# Altium schematic sheet Power_Supplies.SchDoc: POE Voltage Regulator
size A3; Author: A.Horvath; Organization: Reichle & De-Massari; Address1: Binzstrasse 32; Address2: 8620 Wetzikon; Address3: Switzerland; DocumentNumber: 11; Revision: V0.1; SheetNumber: 11; SheetTotal: 11
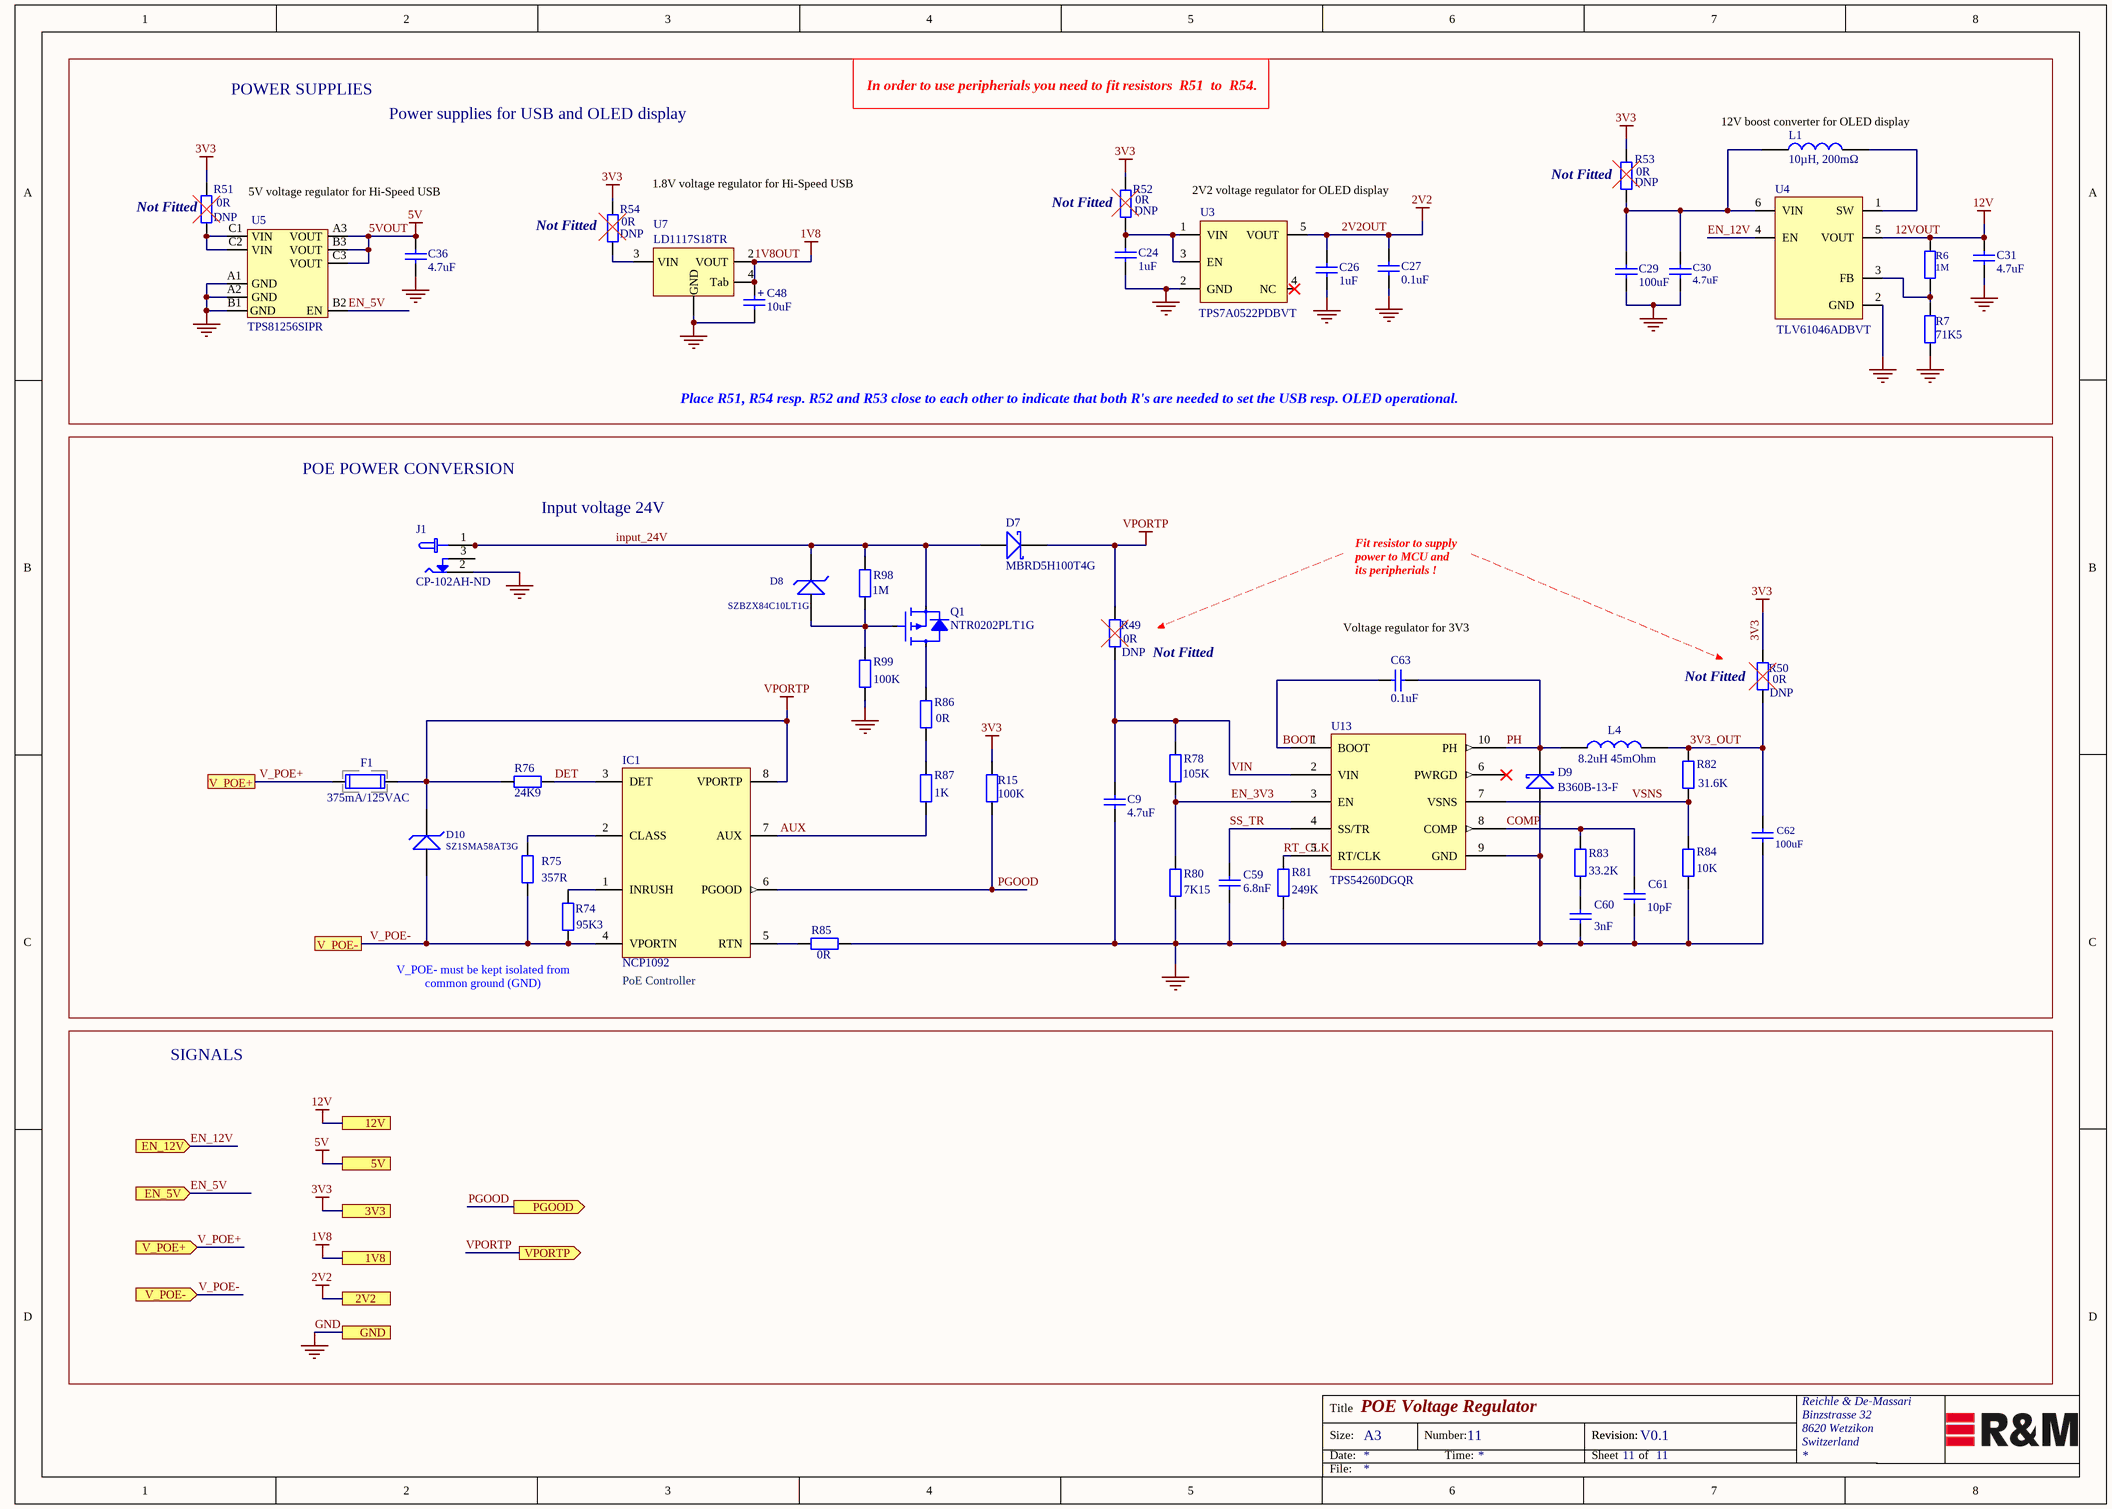
[diagram p0: Power_Supplies.SchDoc]

## Parts
C9  4.7uF  [Ceramic Capacitor 0402 EIA]
C24  1uF  [Ceramic Capacitor 0402 EIA]
C26  1uF  [Ceramic Capacitor 0402 EIA]
C27  0.1uF  [Ceramic Capacitor 0402 EIA]
C29  100uF  [Ceramic Capacitor 1210 EIA]
C30  4.7uF  [CAP-0402[1005] - RFL]
C31  4.7uF  [Ceramic Capacitor 0603 EIA]
C36  4.7uF  [Ceramic Capacitor 0603 EIA]
C48  10uF  [Ceramic Capacitor 1206 - Tantal]
C59  6.8nF  [Ceramic Capacitor 0402 EIA]
C60  3nF  [Ceramic Capacitor 0402 EIA]
C61  10pF  [Ceramic Capacitor 0402 EIA]
C62  100uF  [CAP-1210[3225] - RFL]
C63  0.1uF  [Ceramic Capacitor 0402 EIA]
D7  MBRD5H100T4G  [DPAK_MBRD5H]
D8  SZBZX84C10LT1G  [SOT-23_BZX84]
D9  B360B-13-F  [SMB]
D10  SZ1SMA58AT3G  [SMA_SZ1SMA58AT3G]
F1  375mA/125VAC  [Littlefuse_Holder]
IC1  NCP1092  [SOIC127P602X173-8N]
J1  CP-102AH-ND  [CUI_PJ-102AH]
L1  10µH, 200mΩ  [FDSD0420]
L4  8.2uH 45mOhm  [SRN80408R2Y]
Q1  NTR0202PLT1G  [SOT-23_NTR0202PLT1G]
R6  1M  [Resistor 0402 EIA]
R7  71K5  [Resistor 0402 EIA]
R15  100K  [Resistor 0402 EIA]
R49  DNP  [Resistor 0805 EIA]
R50  DNP  [Resistor 0805 EIA]
R51  DNP  [Resistor 0805 EIA]
R52  DNP  [Resistor 0805 EIA]
R53  DNP  [Resistor 0805 EIA]
R54  DNP  [Resistor 0805 EIA]
R74  95K3  [Resistor 0402 EIA]
R75  357R  [Resistor 0402 EIA]
R76  24K9  [Resistor 0402 EIA]
R78  105K  [Resistor 0402 EIA]
R80  7K15  [Resistor 0402 EIA]
R81  249K  [Resistor 0402 EIA]
R82  31.6K  [Resistor 0402 EIA]
R83  33.2K  [Resistor 0402 EIA]
R84  10K  [Resistor 0402 EIA]
R85  0R  [Resistor 0805 EIA]
R86  0R  [Resistor 0805 EIA]
R87  1K  [Resistor 0402 EIA]
R98  1M  [Resistor 0805 EIA]
R99  100K  [Resistor 0805 EIA]
U3  TPS7A0522PDBVT  [SOT23-5L]
U4  TLV61046ADBVT  [SOT-23-6]
U5  TPS81256SIPR  [BGASIP0009A]
U7  LD1117S18TR  [SOT-223]
U13  TPS54260DGQR  [TPS54260_S-PDSO-G10]

## Ports
1V8, 2V2, 3V3, 5V, 12V, EN_5V (in), EN_12V (in), GND, PGOOD (out), V_POE+ (in), V_POE- (in), VPORTP (out)

## Nets
1V8OUT: C48.1(pos) U7.2(VOUT) U7.4(Tab) ; port 1V8  [also labelled 1V8]
2V2OUT: C26.2 C27.2 U3.5(VOUT) ; port 2V2  [also labelled 2V2]
3V3: R15.1 R50.1 R51.1 R52.1 R53.1 R54.1 ; port 3V3
5VOUT: C36.2 U5.A3(VOUT) U5.B3(VOUT) U5.C3(VOUT) ; port 5V  [also labelled 5V]
12VOUT: C31.2 R6.1 U4.5(VOUT) ; port 12V  [also labelled 12V]
GND: C9.1 C24.1 C26.1 C27.1 C29.1 C30.2(Neg) C31.1 C36.1 C48.2(neg) C59.1 C60.1 C61.1 C62.2(Neg) D9.2(A) J1.2 R7.2 R80.2 R81.2 R84.2 R85.2 R99.2 U3.2(GND) U4.2(GND) U5.A1(GND) U5.A2(GND) U5.B1(GND) U7.1(GND) U13.9(GND) ; port GND
VPORTP: D7.4(K) D10.1(K) F1.2 IC1.8(VPORTP) R49.1 R76.1 ; port VPORTP
3V3_OUT: C62.1(Pos) L4.2 R50.2 R82.1
AUX: IC1.7(AUX) R87.2
BOOT: C63.2 U13.1(BOOT)
COMP: C61.2 R83.1 U13.8(COMP)
DET: IC1.3(DET) R76.2
EN_3V3: R78.2 R80.1 U13.3(EN)
EN_5V: U5.B2(EN) ; port EN_5V
EN_12V: U4.4(EN) ; port EN_12V
input_24V: D7.3(A) D8.3(K) J1.1 Q1.3 R98.1
PGOOD: IC1.6(PGOOD) R15.2 ; port PGOOD
PH: C63.1 D9.1(K) L4.1 U13.10(PH)
RT_CLK: R81.1 U13.5(RT/CLK)
SS_TR: C59.2 U13.4(SS/TR)
V_POE+: F1.1 ; port V_POE+
V_POE-: D10.2(A) IC1.4(VPORTN) R74.2 R75.2 ; port V_POE-
VIN: C9.2 R49.2 R78.1 U13.2(VIN)
VSNS: R82.2 R84.1 U13.7(VSNS)
NetC24_2: C24.2 R52.2 U3.1(VIN) U3.3(EN)
NetC29_2: C29.2 C30.1(Pos) L1.1 R53.2 U4.6(VIN)
NetC60_2: C60.2 R83.2
NetD8_1: D8.1(A) Q1.1 R98.2 R99.1
NetIC1_1: IC1.1(INRUSH) R74.1
NetIC1_2: IC1.2(CLASS) R75.1
NetIC1_5: IC1.5(RTN) R85.1
NetL1_2: L1.2 U4.1(SW)
NetQ1_2: Q1.2 R86.1
NetR6_2: R6.2 R7.1 U4.3(FB)
NetR51_2: R51.2 U5.C1(VIN) U5.C2(VIN)
NetR54_2: R54.2 U7.3(VIN)
NetR86_2: R86.2 R87.1

Not connected (* = marked no-connect by the designer): J1 3; U3 4(NC)*; U13 6(PWRGD)*

## Notes on the sheet
- POWER SUPPLIES
- In order to use peripherials you need to fit resistors  R51  to  R54.
- Power supplies for USB and OLED display
- (near R53) Not Fitted
- (near R53) 0R
- (near L1) 12V boost converter for OLED display
- (near R51) Not Fitted
- (near R51) 0R
- 5V voltage regulator for Hi-Speed USB
- (near R54) Not Fitted
- (near R54) 0R
- 1.8V voltage regulator for Hi-Speed USB
- (near R52) Not Fitted
- (near R52) 0R
- (near U3) 2V2 voltage regulator for OLED display
- Place R51, R54 resp. R52 and R53 close to each other to indicate that both R's are needed to set the USB resp. OLED operational.
- POE POWER CONVERSION
- (near J1) Input voltage 24V
- Fit resistor to supply power to MCU and its peripherials !
- (near R49) 0R
- (near C63) Voltage regulator for 3V3
- (near R49) Not Fitted
- (near R50) Not Fitted
- (near R50) 0R
- V_POE+
- V_POE-
- V_POE- must be kept isolated from common ground (GND)
- (near IC1) PoE Controller
- SIGNALS
- Title
- Size:
- Date:
- A3
- Number:
- Time:
- Revision:
- Sheet
- of
- File:
- (in symbol Cap_10uF_1206_10V) +

## Library data of the parts
C9 = Cap_4.7uF_0402_10V: 4.7µF ±10% 10V Ceramic Capacitor X5R 0402 (1005 Metric); Manufracturer: Samsung Electro-Mechanics; Manufacturer PartNr: CL05A475KP5NRNC; voltage: 10VDC; Replaceable: yes; tolerance: 10%; ComponentLink1Description: mouser; ComponentLink1URL: https://www.mouser.ch/ProductDetail/Murata-Electronics/GRM155R60J475ME47D?qs=sGAEpiMZZMs0AnBnWHyRQIE6q%2f4qwWvwbJmEUwav8%2f4%3d; Dielectric Grade: X5R; Footprint/Package: 0402 (1005 metric); Supplier 1: Digi-Key; Supplier Part Number 1: 1276-1480-1-ND; value: 4.7uF
C24 C26 = Cap_1uF_0402_10V: 1µF ±10% 10V Ceramic Capacitor X7S 0402 (1005 Metric); Manufacturer: Murata; Manufacturer PartNr: GCM155C71A105KE38D; voltage: 10VDC; Replaceable: yes; value: 1uF; tolerance: 10%; Footprint/Package: 0402 (1005 metric); Dielectric Grade: X7S; ComponentLink1Description: mouser; ComponentLink1URL: https://www.mouser.ch/ProductDetail/Murata-Electronics/GCM155C71A105KE38D?qs=sGAEpiMZZMsh%252b1woXyUXj0FEAttKcN54ouz5zO04smg%3d; Supplier Part Number 1: 490-13409-1-ND; Supplier 1: Digi-Key
C27 = Cap_0.1uF_0402_16V: 0.1µF ±20% 16V Ceramic Capacitor X7R 0402 (1005 Metric); Manufacturer: KEMET; Manufacturer PartNr: C0402C104M4RACAUTO; voltage: 16VDC; Replaceable: yes; value: 0.1uF; tolerance: 20%; Footprint/Package: 0402 (1005 Metric); Dielectric Grade: X7R; ComponentLink1Description: mouser; ComponentLink1URL: https://www.mouser.ch/ProductDetail/KEMET/C0402C104M4RACAUTO?qs=sGAEpiMZZMs0AnBnWHyRQB295tntAovf0Dzw3tVX6zRfKTwHFThmZw%3d%3d; Supplier 1: Digi-Key; Supplier Part Number 1: 399-13707-1-ND
C29 = Cap_100uF_1210_6.3V: 100µF ±20% 6.3V Ceramic Capacitor X5R 1206 (3216 Metric); Manufacturer: Murata; Manufacturer PartNr: GRM31CR60J107ME39L; Replaceable: yes; Dielectric Grade: X7S; value: 100uF; tolerance: 20%; voltage: 6.3V; ComponentLink1Description: mouser; ComponentLink1URL: https://www.mouser.ch/ProductDetail/Murata-Electronics/GRM32EC72A106KE05L?qs=sGAEpiMZZMs0AnBnWHyRQN7%2fAA2D2lPPRgsNRWcxCxSMn45aJ02Wig%3d%3d; Footprint/Package: 1210 (3225 metric); Supplier 1: Digi-Key; Supplier Part Number 1: 490-4539-1-ND
C30 = Cap_4.7uF_0402_6.3V: 4.7µF ±20% 6.3V Ceramic Capacitor X5R 0402 (1005 Metric); Manufacturer: Murata; Manufacturer PartNr: GRM155R60J475ME47D; voltage: 6.3VDC; Replaceable: yes; tolerance: ±20%; Supplier 1: Digi-Key; Supplier Part Number 1: 490-5915-1-ND; Dielectric Grade: X5R; value: 4.7uF; Footprint/Package: 0402 (1005 metric)
C31 = Cap_4.7uF_0603_35V: 4.7µF ±10% 35V Ceramic Capacitor X5R 0603 (1608 Metric); Manufracturer: Murata Electronics; Manufacturer PartNr: GRM188R6YA475KE15D; voltage: 35 VDC; Replaceable: yes; value: 4.7uF; tolerance: 10%; Dielectric Grade: X5R; Footprint/Package: 0603 (1608 metric); Supplier 1: Digi-Key; Supplier Part Number 1: 490-7205-1-ND; power: -
C36 = Cap_4.7uF_0603_16V: 4.7µF ±10% 16V Ceramic Capacitor X5R 0603 (1608 Metric); Manufracturer: Murata Electronics; Manufacturer PartNr: GRM188R61C475KAAJD; voltage: 16 VDC; Replaceable: yes; value: 4.7uF; tolerance: 10%; Dielectric Grade: X5R; Footprint/Package: 0603 (1608 metric); Supplier 1: Digi-Key; Supplier Part Number 1: 490-10481-1-ND
C48 = Cap_10uF_1206_10V: 10µF Molded Tantalum Capacitors 10V 1206 (3216 Metric) 3.4Ohm; Manufacturer: Vishay Sprague; Manufacturer PartNr: 293D106X9010A2TE3; tolerance: ±10%; Replaceable: yes; Dielectric Grade: Tantal; value: 10uF; voltage: 10V; ComponentLink1Description: mouser; ComponentLink1URL: https://www.mouser.ch/ProductDetail/Murata-Electronics/GRM32EC72A106KE05L?qs=sGAEpiMZZMs0AnBnWHyRQN7%2fAA2D2lPPRgsNRWcxCxSMn45aJ02Wig%3d%3d; Footprint/Package: 1206 (3216 metric); Supplier 1: Digi-Key; Supplier Part Number 1: 718-1121-1-ND
C59 = Cap_6.8nF_0402_50V: 6800pF ±10% 50V Ceramic Capacitor X7R 0402 (1005 Metric); Manufacturer: KEMET; Manufacturer PartNr: C0402C682K5RACTU; voltage: 50VDC; Replaceable: yes; Supplier 1: Digi-Key; Supplier Part Number 1: 399-3074-1-ND; Footprint/Package: 0402 (1005 metric); tolerance: 10%; value: 6.8nF; ComponentLink1URL: http://www.mouser.com/ds/2/400/lcc_commercial_general_en-837201.pdf; ComponentLink1Description: http://www.mouser.com/ds/2/400/lcc_commercial_general_en-837201.pdf; ComponentLink2URL: https://product.tdk.com/info/en/documents/chara_sheet/C1005X7R1H682K050BA.pdf; ComponentLink2Description: https://product.tdk.com/info/en/documents/chara_sheet/C1005X7R1H682K050BA.pdf; ComponentLink3URL: https://product.tdk.com/en/products/common/pdf/mlcc_partnumber_description.pdf; ComponentLink3Description: https://product.tdk.com/en/products/common/pdf/mlcc_partnumber_description.pdf; Dielectric Grade: X7R
C60 = Cap_3nF_0402_10V: 3000pF, 3nF, ±5% 10V Ceramic Capacitor U2J 0402 (1005 Metric); Manufacturer: Murata; Manufacturer PartNr: GRM1557U1A302JA01D; Replaceable: yes; power: NA; Supplier 1: Digi-Key; Supplier Part Number 1: 490-8243-2-ND; Footprint/Package: 0402 (1005 Metric); value: 3nF; tolerance: 5%; voltage: 10V; Dielectric Grade: U2J; ComponentLink1URL: http://psearch.murata.com/capacitor/product/GRM1557U1A302JA01%23.pdf; ComponentLink1Description: http://psearch.murata.com/capacitor/product/GRM1557U1A302JA01%23.pdf; ComponentLink2URL: https://www.murata.com/~/media/webrenewal/support/library/catalog/products/capacitor/mlcc/c02e.ashx?la=en-us; ComponentLink2Description: https://www.murata.com/~/media/webrenewal/support/library/catalog/products/capacitor/mlcc/c02e.ashx?la=en-us
C61 = Cap_10pF_0402_50V: 10pF ±1% 50V Ceramic Capacitor C0G, NP0 0402 (1005 Metric); Manufracturer: Murata Electronics; Manufacturer PartNr: GJM1555C1H100FB01D; voltage: 50VDC; Replaceable: yes; Dielectric Grade: C0G (NP0); tolerance: 1%; ComponentLink1Description: mouser; ComponentLink1URL: https://www.mouser.ch/ProductDetail/Murata-Electronics/GRM155R60J475ME47D?qs=sGAEpiMZZMs0AnBnWHyRQIE6q%2f4qwWvwbJmEUwav8%2f4%3d; Footprint/Package: 0402 (1005 metric); Supplier 2: Mouser; Supplier Part Number 2: 81-GJM1555C1H100FB01; value: 10pF; Supplier 1: Digi-Key; Supplier Part Number 1: 0402 (1005 Metric)
C62 = Cap_100uF_1210_10V: 100µF ±20% 10V Ceramic Capacitor X5R 1210 (3225 Metric); Manufacturer: Murata; Manufacturer PartNr: GRM32ER61A107ME20L; Replaceable: yes; voltage: 10VDC; value: 100uF; Dielectric Grade: X5R; Footprint/Package: 1210 (3225 metric); Supplier 1: Digi-Key; Supplier Part Number 1: 490-9969-1-ND; tolerance: ±20%
C63 = Cap_0.1uF_0402_10V: 0.1µF ±20% 10V Ceramic Capacitor X5R 0402 (1005 Metric); Manufacturer: Wurth Electronics; Manufacturer PartNr: 885012105010; voltage: 10VDC; Replaceable: yes; value: 0.1uF; tolerance: 20%; Footprint/Package: 0402; Dielectric Grade: X5R; ComponentLink1Description: mouser; ComponentLink1URL: https://www.mouser.ch/ProductDetail/Wurth-Electronics/885012105010?qs=sGAEpiMZZMs0AnBnWHyRQEGbLOF2VP1ihL84oCjXnlO407YOHi%2fQbw%3d%3d; Supplier 1: Digi-Key; Supplier 2: Farnell; Supplier 3: Mouser; Supplier Part Number 3: 710-885012105010; Supplier Part Number 2: 2533928; Supplier Part Number 1: 732-7487-1-ND
D7 = Diode_MBRD5H100T4G: Gleichrichter Diode Schottky 100V 5A Oberflächenmontage DPAK; Manufacturer: ON Semiconductor; Replaceable: no; Footprint/Package: DPAK; Supplier 1: Digi-Key; Supplier Part Number 1: MBRD5H100T4GOSCT-ND; value: MBRD5H100T4G; Manufacturer PartNr: MBRD5H100T4G
D8 = Diode_SZBZX84C10LT1G: Zener Diode 10V 225mW ±6% Oberflächenmontage SOT-23-3 (TO-236); Manufacturer: ON Semiconductor; Replaceable: no; Manufacturer PartNr: SZBZX84C10LT1G; Footprint/Package: SOT-23-3 (TO-236); Supplier 1: Digi-Key; Supplier Part Number 1: SZBZX84C10LT1GOSDKR-ND; power: 225mW; value: SZBZX84C10LT1G; voltage: 10V
D9 = Diode_B360B-13-F: Diode Schottky 60V 3A Surface Mount SMB; Manufacturer: Diodes Incorporated; Replaceable: no; ComponentLink1Description: mouser; ComponentLink1URL: https://www.mouser.ch/ProductDetail/Diodes-Incorporated/B360B-13-F?qs=sGAEpiMZZMtQ8nqTKtFS%2fP8bhA82jfmw8ipi2fZa5J8%3d; Manufacturer PartNr: B360B-13-F; Footprint/Package: DO-214AA, SMB; Supplier 2: Mouser; Supplier 1: Digi-Key; Supplier Part Number 2: 621-B360B-F; Supplier Part Number 1: B360B-FDIDKR-ND; value: B360B-13-F
D10 = Diode_SZ1SMA58AT3G: 93.6V Clamp 4.3A Ipp Tvs Diode Surface Mount SMA; Manufacturer: Littelfuse Inc.; Replaceable: no; power: 400W; Manufacturer PartNr: SZ1SMA58AT3G; Footprint/Package: DO-214AC, SMA; Supplier 1: Digi-Key; Supplier Part Number 1: F11530CT-ND; value: SZ1SMA58AT3G; voltage: 93.6V
F1 = FUSE_375mA 125AC: 375mA, 125V AC 125V DC Fuse with surfacemount holder, 2-SMD; Manufacturer: Littlefuse Inc.; Manufacturer PartNr: 0154.375DR; Replaceable: no; tolerance: NA; voltage: 125VAC/125VDC; Supplier 1: Digi-Key; Supplier Part Number 1: F3150CT-ND; value: 375mA/125VAC; Footprint/Package: 2-SMD see datasheet
IC1 = NCP1092DG: Power Over Ethernet Controller 1 Channel 802.3af (PoE) 8-SOIC; Manufacturer: ON Semiconductor; Replaceable: no; Supplier 1: Digi-Key; Supplier Part Number 1: NCP1092DGOS-ND; Manufacturer Part Number: NCP1092DG; Footprint/Package: SOIC; ComponentLink1URL: http://www.onsemi.com/pub/Collateral/NCP1090-D.PDF; ComponentLink1Description: http://www.onsemi.com/pub/Collateral/NCP1090-D.PDF; ComponentLink2URL: http://www.farnell.com/datasheets/1339888.pdf; ComponentLink2Description: http://www.farnell.com/datasheets/1339888.pdf; ComponentLink3URL: http://www.onsemi.jp/pub_link/Collateral/NCP1090-D.PDF; ComponentLink3Description: http://www.onsemi.jp/pub_link/Collateral/NCP1090-D.PDF; ComponentLink4URL: http://www.mouser.com/ds/2/308/NCP1090-D-45905.pdf; ComponentLink4Description: http://www.mouser.com/ds/2/308/NCP1090-D-45905.pdf
J1 = PowerJack-102AH: PJ-102 Series 2 x 6.5 mm 24 V Horizontal Power Jack w/ Tapered PC Pins,Through Hole, Right Angle; Manufacturer: CUI Devices; Manufacturer PartNr: PJ-102AH; Replaceable: NO; Supplier 1: Digi-Key; Supplier Part Number 1: CP-102AH-ND; Footprint/Package: THD
L1 = Ind_10uH_4.2x4.2mm: 10µH Shielded Wirewound Inductor 1.7A 200mOhm Max Nonstandard; Manufacturer: Murata Electronics; Manufacturer PartNr: FDSD0420-H-100M=P3; Replaceable: no; Supplier 1: Digi-Key; Supplier Part Number 1: 490-10861-1-ND; Footprint/Package: Specific see datasheet; value: 10µH, 200mΩ; ComponentLink1Description: Datasheet; ComponentLink1URL: https://www.bourns.com/docs/Product-Datasheets/SRN8040.pdf; tolerance: -; power: -; Dielectric Grade: -
L4 = Ind_SRN8040-8R2Y: 8.2µH Semi-Shielded Wirewound Inductor 3.7A 45mOhm Max Nonstandard; Manufacturer: Bourns; Replaceable: no; Manufacturer PartNr: SRN8040-8R2Y; Supplier 1: Digi-Key; Supplier Part Number 1: SRN8040-8R2YCT-ND; Footprint/Package: Specific see datasheet; value: 8.2µH; ComponentLink1Description: Datasheet; ComponentLink1URL: https://www.bourns.com/docs/Product-Datasheets/SRN8040.pdf; tolerance: -; power: -
Q1 = FET_NTR0202PLT1G: P-Channel 20V 400mA (Ta) 225mW (Ta) Surface Mount SOT-23-3 (TO-236); Manufacturer: ON Semiconductor; tolerance: NA; Replaceable: no; value: NTR0202PLT1G; voltage: 20V; Manufacturer PartNr: NTR0202PLT1G; Footprint/Package: SOT-23-3 (TO-236); Dielectric Grade: NA; ComponentLink1Description: mouser; ComponentLink1URL: https://www.mouser.ch/ProductDetail/Murata-Electronics/GCM155C71A105KE38D?qs=sGAEpiMZZMsh%252b1woXyUXj0FEAttKcN54ouz5zO04smg%3d; Supplier Part Number 1: NTR0202PLT1GOSCT-ND; Supplier 1: Digi-Key; power: 225mW
R6 = Res_1M_0402: 1 MOhms ±1% 0.1W, 1/10W Chip Resistor 0402 (1005 Metric) Anti-Sulfur Thin Film; Manufacturer: Vishay Beyschlag; Manufacturer PartNr: MCS04020C1004FE000; Replaceable: yes; Supplier 1: Digi-Key; Supplier Part Number 1: MCS0402-1.00M-CFCT-ND; Footprint/Package: 0402 (1005 metric); value: 1M; power: 0.1W, 1/10W; tolerance: ±1%; Dielectric Grade: -
R7 = Res_71K5_0402: 71.5 kOhms ±1% 0.1W, 1/10W Chip Resistor 0402 (1005 Metric) Automotive AEC-Q200, Moisture Resistant Thick Film; Manufacturer: KOA Speer Elec.; Manufacturer PartNr: RK73H1ETTP7152F; power: 0.01W,  1/10W; Replaceable: yes; Supplier 1: Digi-Key; Supplier Part Number 1: 2019-RK73H1ETTP7152FCT-ND; Case/Package: 0402 (1005 metric); Tolerance: ±1%; value: 71K5; ComponentLink1URL: http://documents.rs-components.com/techlib://itc_doclist_GB.htm?stockno=7016664; ComponentLink1Description: http://documents.rs-components.com/techlib://itc_doclist_GB.htm?stockno=7016664
R15 = Res_100K_0402: 100 kOhms ±0,1% 0,063W, 1/16W Chip-Widerstand 0402 (1005 metrisch) Dünnschicht; Manufacturer: Yageo; Manufacturer PartNr: RT0402BRD07100KL; tolerance: ±0.1%; Replaceable: yes; value: 100K; power: 0,063W, 1/16W; Footprint/Package: 0402 (1005 metrisch); Supplier 1: Digi-Key; Supplier Part Number 1: YAG1343CT-ND
R49-R54 = Res_DNP_0805: Resistor: do not populate; Replaceable: no; value: DNP; tolerance: *; power: *; Manufacturer: do not populate; Footprint/Package: 0805; Manufacturer PartNr: do not populate
R74 = Res_95K3_0402: 95.3 kOhms ±0.1% 0.063W, 1/16W Chip Resistor 0402 (1005 Metric) Automotive AEC-Q200 Thin Film; Manufacturer: Panasonic; Manufacturer PartNr: ERA-2AEB9532X; power: 63mW; Replaceable: no; Supplier 2: Mouser; Footprint/Package: 0402 (1005 metric); value: 95K3; tolerance: 0.1%; Supplier Part Number 2: 667-ERA-2AEB9532X; Supplier Part Number 1: P95.3KDCCT-ND; Supplier 1: Digi-Key
R75 = Res_357R_0402: 357 Ohms ±1% 0.063W, 1/16W Chip Resistor 0402 (1005 Metric) Thick Film; Manufacturer: Bourns; Manufacturer PartNr: CR0402-FX-3570GLF; Replaceable: yes; Supplier 2: Mouser; Footprint/Package: 0402 (1005 metric); value: 357R; tolerance: ±1%; power: 0.063W; ComponentLink1URL: http://www.bourns.com/docs/Product-Datasheets/CR0402.pdf; ComponentLink1Description: http://www.bourns.com/docs/Product-Datasheets/CR0402.pdf; ComponentLink2URL: http://www.bourns.com/pdfs/CR0402.pdf; ComponentLink2Description: http://www.bourns.com/pdfs/CR0402.pdf; ComponentLink3URL: http://www.mouser.com/ds/2/54/r0402-777514.pdf; ComponentLink3Description: http://www.mouser.com/ds/2/54/r0402-777514.pdf; Supplier Part Number 2: 652-CR0402-FX3570GLF; Supplier 1: Digi-Key; Supplier Part Number 1: CR0402-FX-3570GLF-ND
R76 = Res_24K9_0402: 24.9 kOhms ±1% 0.1W, 1/10W Chip Resistor 0402 (1005 Metric) Thick Film; Manufacturer: Panasonic; Manufacturer PartNr: ERJ-2RKF2492X; Replaceable: yes; Supplier 2: Mouser; Supplier Part Number 2: 667-ERJ-2RKF2492X; Supplier 1: Digi-Key; Footprint/Package: 0402 (1005 metric); tolerance: ±1%; ComponentLink1URL: https://industrial.panasonic.com/cdbs/www-data/pdf/RDA0000/DMA0000COL11.pdf; ComponentLink1Description: https://industrial.panasonic.com/cdbs/www-data/pdf/RDA0000/DMA0000COL11.pdf; ComponentLink2URL: http://www.farnell.com/datasheets/426256.pdf; ComponentLink2Description: http://www.farnell.com/datasheets/426256.pdf; value: 24K9; Supplier Part Number 1: P24.9KLCT-ND; power: 0.1W
R78 = Res_105K_0402: 105 kOhms ±1% 0.1W, 1/10W Chip Resistor 0402 (1005 Metric) Automotive AEC-Q200 Thick Film; Manufacturer: Panasonic; Manufacturer PartNr: ERJ-2RKF1053X; Replaceable: yes; Supplier 1: Digi-Key; Supplier Part Number 1: P105KLCT-ND; Footprint/Package: 0402 (1005 metric); tolerance: ±1%; power: 0.1W, 1/10W; value: 105K; ComponentLink1URL: http://www.alliedelec.com/m/d/623f45ff1957d936ff56d46fd1c28cac.pdf; ComponentLink1Description: http://www.alliedelec.com/m/d/623f45ff1957d936ff56d46fd1c28cac.pdf; ComponentLink2URL: http://industrial.panasonic.com/www-data/pdf/AOA0000/AOA0000CE2.pdf; ComponentLink2Description: http://industrial.panasonic.com/www-data/pdf/AOA0000/AOA0000CE2.pdf; ComponentLink3URL: http://www.farnell.com/datasheets/1694929.pdf; ComponentLink3Description: http://www.farnell.com/datasheets/1694929.pdf; ComponentLink4URL: http://www.farnell.com/datasheets/1911175.pdf; ComponentLink4Description: http://www.farnell.com/datasheets/1911175.pdf; ComponentLink5URL: http://www.farnell.com/datasheets/1678782.pdf; ComponentLink5Description: http://www.farnell.com/datasheets/1678782.pdf
R80 = Res_7K15_0402: 7.15 kOhms ±0.1% 0.063W, 1/16W Chip Resistor 0402 (1005 Metric) Anti-Sulfur, Automotive AEC-Q200 Thin Film; Manufacturer: TE Connectivity; Manufacturer PartNr: RQ73C1E7K15BTD; Replaceable: yes; Supplier 1: Digi-Key; Supplier Part Number 1: A139461CT-ND; Case/Package: 0402 (1005 metric); Tolerance: ±0.1%; value: 7K15; power: 0.063W, 1/16W; ComponentLink1URL: http://documents.rs-components.com/techlib://itc_doclist_GB.htm?stockno=7016664; ComponentLink1Description: http://documents.rs-components.com/techlib://itc_doclist_GB.htm?stockno=7016664
R81 = Res_249K_0402_50V: 249 kOhms ±1% 0.063W, 1/16W Chip Resistor 0402 (1005 Metric) Automotive AEC-Q200 Thick Film; Manufacturer: Vishay Dale; Manufacturer PartNr: CRCW0402249KFKED; voltage: 50V; Replaceable: yes; Supplier 1: Digi-Key; Supplier Part Number 1: 541-249KLCT-ND; Case/Package: 0402 (1005 metric); value: 249K; tolerance: ±1%; power: 0.063W, 1/16W; ComponentLink1URL: http://www.vishay.com/docs/20008/dcrcw.pdf; ComponentLink1Description: http://www.vishay.com/docs/20008/dcrcw.pdf
R82 = Res_31K6_ 0402: 31.6 kOhms ±0.1% 0.063W, 1/16W Chip Resistor 0402 (1005 Metric) Automotive AEC-Q200 Thin Film; Manufacturer: Panasonic; Manufacturer PartNr: ERA-2AEB3162X; voltage: NA; Replaceable: yes; Supplier 1: Digi-Key; Supplier Part Number 1: P31.6KDCCT-ND; Footprint/Package: 0402 (1005 metric); value: 31.6K; Tolerance: 0.1%; power: 0.063W, 1/16W; Dielectric grade: NA
R83 = Res_33K2_0402: 33.2 kOhms ±0.1% 0.063W, 1/16W Chip Resistor 0402 (1005 Metric) Thin Film; Manufacturer: TE Connectivity; Manufacturer PartNr: CPF0402B33K2E1; Replaceable: yes; Dielectric Grade: NA; Supplier 1: Digi-Key; Supplier Part Number 1: A102800CT-ND; Footprint/Package: 0402 (1005metric); power: 0.063W, 1/16W; tolerance: 0.1%; ComponentLink1URL: http://www.mouser.com/ds/2/418/NG_CD_1879215_BA-661209.pdf; ComponentLink1Description: http://www.mouser.com/ds/2/418/NG_CD_1879215_BA-661209.pdf; ComponentLink2URL: http://www.farnell.com/datasheets/1786775.pdf; ComponentLink2Description: http://www.farnell.com/datasheets/1786775.pdf; ComponentLink3URL: http://uk.rs-online.com/webdocs/0de4/0900766b80de4f6c.pdf; ComponentLink3Description: http://uk.rs-online.com/webdocs/0de4/0900766b80de4f6c.pdf; value: 33.2K
R84 = Res_10K_0402: SMD 10K ohm 1% 50V General Purpose; Manufacturer: Yageo; Manufacturer PartNr: RC0402FR-1010KL; power: 63mW; Replaceable: yes; value: 10K; tolerance: 1%; ComponentLink1Description: mouser; ComponentLink1URL: https://www.mouser.ch/ProductDetail/Yageo/RC0402FR-1010KL?qs=sGAEpiMZZMtlubZbdhIBIEgN9MQql2m6Sb2LnYlCICU%3d; Footprint/Package: 0402; Supplier 1: Mouser; Supplier Part Number 1: 603-RC0402FR-1010KL; Supplier 2: Digi-Key; Supplier Part Number 2: *
R85 R86 = Res_0R_0805: 0 Ohms Jumper 0.125W, 1/8W Chip Resistor 0805 (2012 Metric) Automotive AEC-Q200 Thick Film; Manufacturer: Panasonic Electronic Components; Manufacturer PartNr: ERJ-6GEY0R00V; Replaceable: yes; value: 0R; tolerance: -; power: 0.125W, 1/8W; Footprint/Package: 0805 (2012 metric); Supplier 1: Digi-Key; Supplier Part Number 1: P0.0ACT-ND
R87 = Res_1K_0402: 1 kOhms ±0.5% 0.063W, 1/16W Chip Resistor 0402 (1005 Metric) Thin Film; Manufacturer: Susumu; Manufacturer PartNr: RR0510P-102-D; Replaceable: yes; value: 1K; tolerance: ±0.5%; power: 1/16W; Footprint/Package: 0402 (1005 metric); Supplier 1: Digi-Key; Supplier Part Number 1: RR05P1.0KDCT-ND
R98 = Res_1M_0805: PANASONIC ELECTRONIC COMPONENTS   ERA6AEB105V   Surface Mount Chip Resistor, Thin Film, AEC-Q200 ERA Series, 1 Mohm, 125 mW,  0.1%, 100 V; Manufacturer PartNr: ERA-6AEB105V; voltage: 100V; power: 125mW; Tolerance: 1%; Supplier 1: Digi-Key; Supplier Part Number 1: P1MDATR-ND; Manufacturer: Panasonic; Footprint/Package: 0805 (2012 metric); value: 1M; ComponentLink1URL: http://uk.rs-online.com/webdocs/0bee/0900766b80beefcc.pdf; ComponentLink1Description: http://uk.rs-online.com/webdocs/0bee/0900766b80beefcc.pdf; ComponentLink2URL: http://www.farnell.com/datasheets/485442.pdf; ComponentLink2Description: http://www.farnell.com/datasheets/485442.pdf; ComponentLink3URL: https://industrial.panasonic.com/cdbs/www-data/pdf/RDM0000/AOA0000C307.pdf; ComponentLink3Description: https://industrial.panasonic.com/cdbs/www-data/pdf/RDM0000/AOA0000C307.pdf; ComponentLink4URL: http://www.farnell.com/datasheets/2052875.pdf; ComponentLink4Description: http://www.farnell.com/datasheets/2052875.pdf; ComponentLink5URL: http://industrial.panasonic.com/www-data/pdf/AOA0000/AOA0000CE26.pdf; ComponentLink5Description: http://industrial.panasonic.com/www-data/pdf/AOA0000/AOA0000CE26.pdf; ComponentLink6URL: http://www.alliedelec.com/m/d/b6b0537e86f421aa7f5975bb1d8f429a.pdf; ComponentLink6Description: http://www.alliedelec.com/m/d/b6b0537e86f421aa7f5975bb1d8f429a.pdf; ComponentLink7URL: http://www.produktinfo.conrad.com/datenblaetter/450000-474999/458432-da-01-en-WIDERSTAND_0805_ERA.pdf; ComponentLink7Description: http://www.produktinfo.conrad.com/datenblaetter/450000-474999/458432-da-01-en-WIDERSTAND_0805_ERA.pdf
R99 = Res_100K_0805: 100 kOhms ±0.1% 0.125W, 1/8W Chip Resistor 0805 (2012 Metric) Automotive AEC-Q200 Thin Film; Manufacturer: Panasonic Electronic Components; Manufacturer PartNr: ERA-6AEB104V; Replaceable: yes; value: 100K; tolerance: ±0.1%; power: 0.125W, 1/8W; Footprint/Package: 0805 (2012 metric); Supplier 1: Digi-Key; Supplier Part Number 1: P100KDACT-ND
U3 = TPS7A0522PDBVT: Linear Voltage Regulator IC 1 Output 200mA fixed output at 2.2V, SOT-23-5; Manufacturer: Texas Instruments; Replaceable: no; voltage: 2,2V; ComponentLink1Description: mouser; ComponentLink1URL: https://www.mouser.ch/ProductDetail/Texas-Instruments/TPS54260DGQR?qs=sGAEpiMZZMvAX9OfPh%252b2NVVXPcZYNNxJ6f9D0IR5ghU%3d; Manufacturer PartNr: TPS7A0522PDBVT; Footprint/Package: SOT-23-5; Supplier 1: Digi-Key; Supplier Part Number 1: 296-TPS7A0522PDBVTCT-ND; Dielectric Grade: -; tolerance: -; value: TPS7A0522PDBVT; power: -
U4 = TLV61046ADBVT: Boost Switching Regulator IC Positive Adjustable 3.3V 1 Output SOT-23-6; Manufacturer: Texas Instruments; Replaceable: no; voltage: 3.3V-28V; ComponentLink1Description: mouser; ComponentLink1URL: https://www.mouser.ch/ProductDetail/Texas-Instruments/TPS54260DGQR?qs=sGAEpiMZZMvAX9OfPh%252b2NVVXPcZYNNxJ6f9D0IR5ghU%3d; Manufacturer PartNr: TLV61046ADBVT; Footprint/Package: SOT-23-6; Supplier 1: Digi-Key; Supplier Part Number 1: 296-46927-1-ND; Dielectric Grade: -; tolerance: -; value: TLV61046ADBVT; power: -
U5 = TPS81256: Boost Switching Regulator IC Positive Fixed 5V 1 Output, Inputrange 2.5 to 5.5V, 9-SMD BGA Module, Texas Instruments; Replaceable: no; ComponentLink1Description: mouser; ComponentLink1URL: https://www.mouser.ch/ProductDetail/Texas-Instruments/TPS54260DGQR?qs=sGAEpiMZZMvAX9OfPh%252b2NVVXPcZYNNxJ6f9D0IR5ghU%3d; Manufacturer: Texas Instruments; Manufacturer PartNr: TPS81256SIPR; Footprint/Package: 9-SMD Module, see datasheet; Supplier 1: Digi-Key; Supplier Part Number 1: 296-30558-1-ND; value: TPS81256SIPR; Dielectric Grade: -; power: -; voltage: 5V
U7 = LD1117S18TR: Linear Voltage Regulator IC 1 Output 800mA fixed output at 1.8V,SOT-223; Manufacturer: STMicroelectronics; Replaceable: no; voltage: 1,8V; ComponentLink1Description: mouser; ComponentLink1URL: https://www.mouser.ch/ProductDetail/Texas-Instruments/TPS54260DGQR?qs=sGAEpiMZZMvAX9OfPh%252b2NVVXPcZYNNxJ6f9D0IR5ghU%3d; Manufacturer PartNr: LD1117S18TR; Footprint/Package: SOT-223; Supplier 1: Digi-Key; Supplier Part Number 1: 497-7308-1-ND; Dielectric Grade: -; tolerance: -; value: LD1117S18TR; power: -
U13 = TPS54260DGQR: Switching Voltage Regulators 3.5-60V 2.5A 2.5MHz Step Down Converter; Manufacturer: Texas Instruments; Replaceable: no; ComponentLink1Description: mouser; ComponentLink1URL: https://www.mouser.ch/ProductDetail/Texas-Instruments/TPS54260DGQR?qs=sGAEpiMZZMvAX9OfPh%252b2NVVXPcZYNNxJ6f9D0IR5ghU%3d; Manufacturer PartNr: TPS54260DGQR; Footprint/Package: S-PDSO-G10; value: TPS54260DGQR; Dielectric Grade: -; voltage: -